# Altium project Regulator.PrjPcb
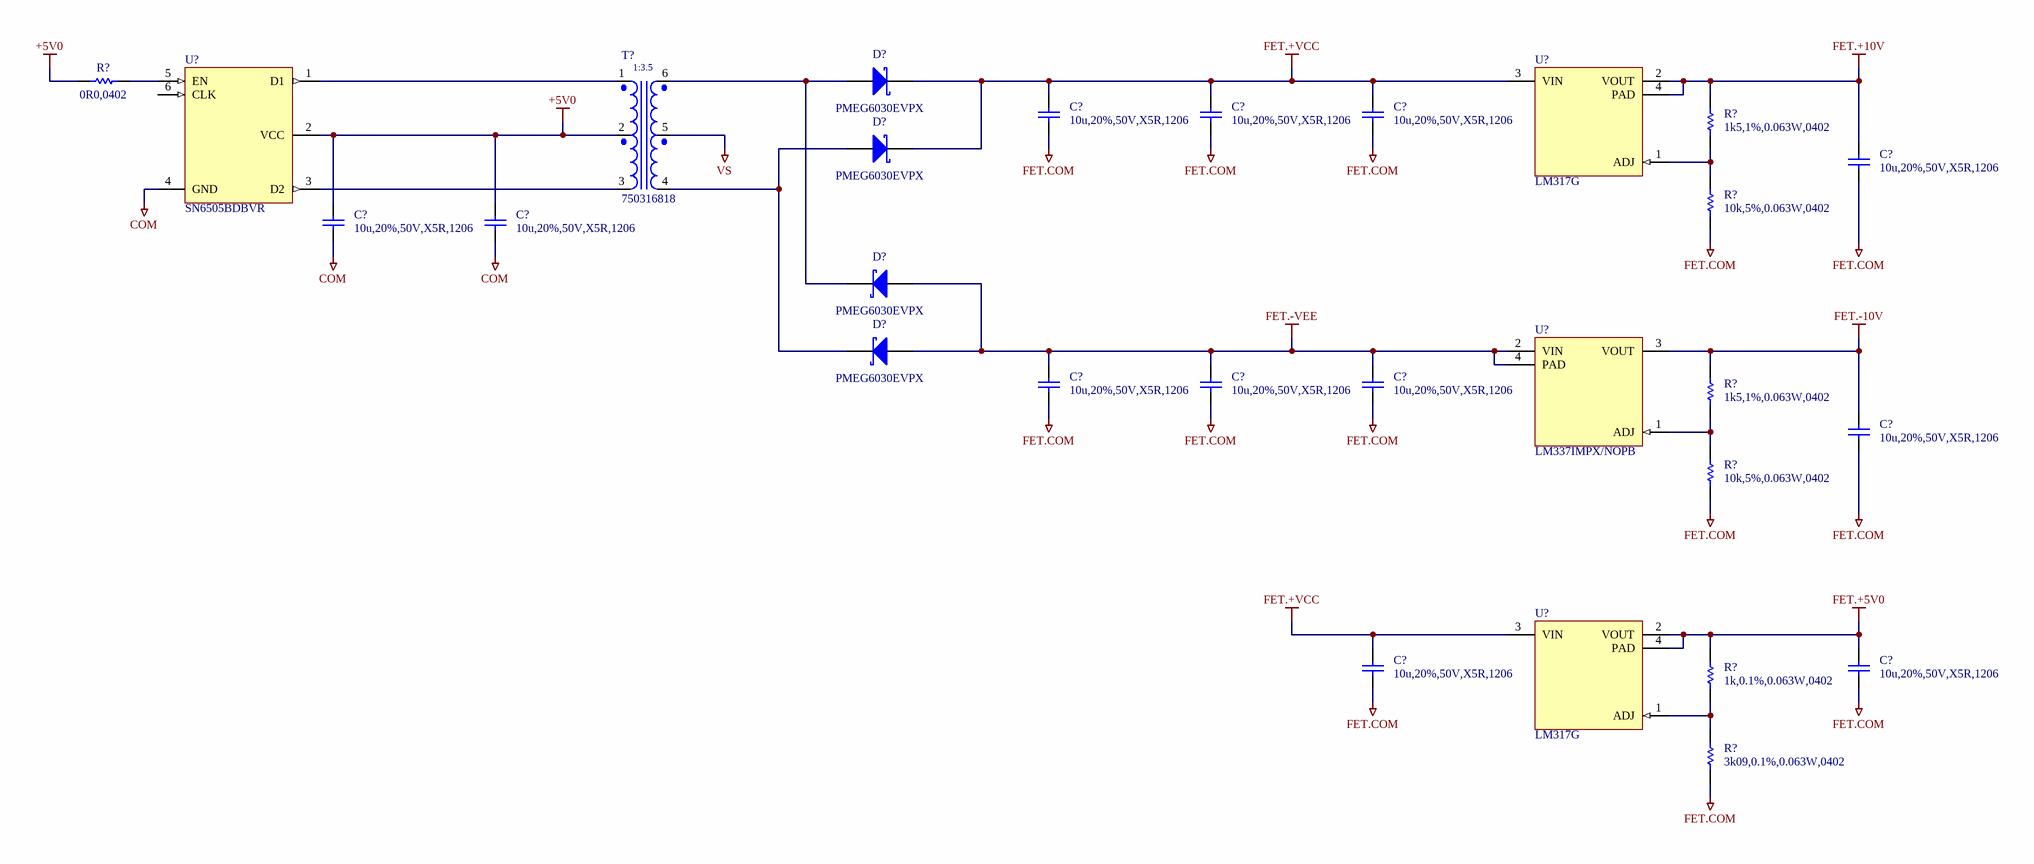
[diagram p0: FET Power.SchDoc]
4 sheets, 72 parts. Net scope: global (net labels, ports and power ports of the same name join across sheets).
Sheets:
  FET Power.SchDoc
  Pass Transistors.SchDoc
  DAC.SchDoc
  FET Microcontroller.SchDoc

## Sheet FET Power.SchDoc
size 406 x 304 mm; SheetNumber: 1; SheetTotal: 4

### Parts
(Parts that share a designator on the sheet are numbered #1, #2 ... from top to bottom, then left to right.)
C?#1  10u,20%,50V,X5R,1206  [CAPC3216X16N]
C?#2  10u,20%,50V,X5R,1206  [CAPC3216X16N]
C?#3  10u,20%,50V,X5R,1206  [CAPC3216X16N]
C?#4  10u,20%,50V,X5R,1206  [CAPC3216X16N]
C?#5  10u,20%,50V,X5R,1206  [CAPC3216X16N]
C?#6  10u,20%,50V,X5R,1206  [CAPC3216X16N]
C?#7  10u,20%,50V,X5R,1206  [CAPC3216X16N]
C?#8  10u,20%,50V,X5R,1206  [CAPC3216X16N]
C?#9  10u,20%,50V,X5R,1206  [CAPC3216X16N]
C?#10  10u,20%,50V,X5R,1206  [CAPC3216X16N]
C?#11  10u,20%,50V,X5R,1206  [CAPC3216X16N]
C?#12  10u,20%,50V,X5R,1206  [CAPC3216X16N]
D?#1  PMEG6030EVPX  [SODFL470X105-2N]
D?#2  PMEG6030EVPX  [SODFL470X105-2N]
D?#3  PMEG6030EVPX  [SODFL470X105-2N]
D?#4  PMEG6030EVPX  [SODFL470X105-2N]
R?#1  0R0,0402  [RESC1005X04N]
R?#2  1k5,1%,0.063W,0402  [RESC1005X04N]
R?#3  10k,5%,0.063W,0402  [RESC1005X04N]
R?#4  1k5,1%,0.063W,0402  [RESC1005X04N]
R?#5  10k,5%,0.063W,0402  [RESC1005X04N]
R?#6  1k,0.1%,0.063W,0402  [RESC1005X04N]
R?#7  3k09,0.1%,0.063W,0402  [RESC1005X04N]
T?  750316818  [WURTH_750316818]
U?#1  SN6505BDBVR  [TEXASINSTRUMENTS_PKG_]
U?#2  LM317G  [UMW_PKG_SOT223-3L]
U?#3  LM337IMPX/NOPB  [TEXASINSTRUMENTS_PKG_DCY]
U?#4  LM317G  [UMW_PKG_SOT223-3L]

### Nets
+5V0: C?#5.2 C?#6.2 R?#1.1 T?.2(PCT) U?#1.2(VCC)
COM: C?#5.1 C?#6.1 U?#1.4(GND)
FET.+5V0: C?#12.2 R?#6.2 U?#4.2(VOUT) U?#4.4(PAD)
FET.+10V: C?#4.2 R?#2.2 U?#2.2(VOUT) U?#2.4(PAD)
FET.+VCC: C?#1.2 C?#2.2 C?#3.2 C?#11.2 D?#1.1(K) D?#2.1(K) U?#2.3(VIN) U?#4.3(VIN)
FET.-10V: C?#10.2 R?#4.2 U?#3.3(VOUT)
FET.-VEE: C?#7.2 C?#8.2 C?#9.2 D?#3.2(A) D?#4.2(A) U?#3.2(VIN) U?#3.4(PAD)
FET.COM: C?#1.1 C?#2.1 C?#3.1 C?#4.1 C?#7.1 C?#8.1 C?#9.1 C?#10.1 C?#11.1 C?#12.1 R?#3.1 R?#5.1 R?#7.1  [project net HVOUT]
VS: T?.5(SCT)
NetD?#1_2: D?#1.2(A) D?#3.1(K) T?.6(S+)
NetD?#2_2: D?#2.2(A) D?#4.1(K) T?.4(S-)
NetR?#1_2: R?#1.2 U?#1.5(EN)
NetR?#2_1: R?#2.1 R?#3.2 U?#2.1(ADJ)
NetR?#4_1: R?#4.1 R?#5.2 U?#3.1(ADJ)
NetR?#6_1: R?#6.1 R?#7.2 U?#4.1(ADJ)
NetT?_1: T?.1(P+) U?#1.1(D1)
NetT?_3: T?.3(P-) U?#1.3(D2)

Not connected (* = marked no-connect by the designer): U?#1 6(CLK)

### Notes on the sheet
- Rev
- Sheet Name:
- Date:
- Sheet
- Designer:
- of
- (in symbol XFR,1-3.5,Lp=86uH,750316818) 1:3.5

### Library data of the parts
C?#1-C?#12 = CAP,Cer,10uF,50VDC,X5R,1206: 10ï¿½F ï¿½20% 50V Ceramic Capacitor X5R 1206 (3216 Metric); Manufacturer 1: Samsung Electro-Mechanics; Manufacturer 1 Part Number: CL31A106MBHNNNE; Vendor 1 Part Number: 1276-6736-1-ND; Vendor 1: Digikey; Part Name: CAP,Cer,10uF,50VDC,X5R,1206; CreatedBy: Judd Foster; HelpURL: https://www.samsungsem.com/resources/file/global/support/product_catalog/MLCC.pdf; Value: 10u
D?#1-D?#4 = DIODE,Schottky,60V,3A,SMD: DIODE SCHOTTKY 60V 3A SOD128; Manufacturer 1: Nexperia USA Inc.; Vendor 1 Part Number: 1727-1349-1-ND; Vendor 1: Digikey; Part Name: DIODE,Schottky,60V,3A,SMD; CreatedBy: Judd Foster; HelpURL: https://assets.nexperia.com/documents/data-sheet/PMEG6030EVP.pdf; Manufacturer 1 Part Number: PMEG6030EVPX
R?#1 = RES,0R0,0402: 0 Ohms Jumper 0.1W, 1/10W Chip Resistor 0402 (1005 Metric) Automotive AEC-Q200 Thick Film; Manufacturer 1: Panasonic Electronic Components; Manufacturer 1 Part Number: ERJ-2GE0R00X; Vendor 1 Part Number: P0.0JCT-ND; Vendor 1: Digikey; Value: 0R; Part Name: RES,0R0,0402; CreatedBy: Judd Foster; HelpURL: https://industrial.panasonic.com/cdbs/www-data/pdf/RDA0000/AOA0000C301.pdf
R?#2 R?#4 = RES,1k5,1%,0.063W,0402: 1.5 kOhms ï¿½1% 0.063W, 1/16W Chip Resistor 0402 (1005 Metric) Moisture Resistant Thick Film; Manufacturer 1: Yageo; Manufacturer 1 Part Number: RC0402FR-071K5L; Vendor 1 Part Number: 311-1.50KLRCT-ND; Vendor 1: Digikey; Part Name: RES,1k5,1%,0.063W,0402; CreatedBy: Judd Foster; HelpURL: https://www.yageo.com/upload/media/product/productsearch/datasheet/rchip/PYu-RC_Group_51_RoHS_L_10.pdf; Value: 1k5
R?#3 R?#5 = RES,10k,5%,0.063W,0402: 10 kOhms ï¿½5% 0.063W, 1/16W Chip Resistor 0402 (1005 Metric) Automotive AEC-Q200 Thick Film; Manufacturer 1: Stackpole Electronics Inc; Manufacturer 1 Part Number: RMCF0402JT10K0; Vendor 1 Part Number: RMCF0402JT10K0CT-ND; Vendor 1: DIgikey; Part Name: RES,10k,5%,0.063W,0402; CreatedBy: Judd Foster; HelpURL: https://www.seielect.com/catalog/sei-rmcf_rmcp.pdf; Value: 10k
R?#6 = RES,1k,0.1%,0.063W,0402: 1 kOhms Â±0.1% 0.063W, 1/16W Chip Resistor 0402 (1005 Metric) Thin Film; Manufacturer 1: YAGEO; Manufacturer 1 Part Number: RT0402BRE071KL; Vendor 1 Part Number: YAG2306CT-ND; Vendor 1: DigiKey; Part Name: RES,1k,0.1%,0.063W,0402; CreatedBy: Judd Foster; HelpURL: https://www.yageo.com/upload/media/product/app/datasheet/rchip/pyu-rt_1-to-0.01_rohs_l.pdf; Value: 1k
R?#7 = RES,3k09,0.1%,0.063W,0402: 3.09 kOhms ï¿½0.1% 0.063W, 1/16W Chip Resistor 0402 (1005 Metric) Thin Film; Manufacturer 1: YAGEO; Manufacturer 1 Part Number: RT0402BRD073K09L; Vendor 1 Part Number: YAG4252CT-ND; Vendor 1: Digikey; Part Name: RES,3k09,0.1%,0.063W,0402; CreatedBy: Judd Foster; HelpURL: https://www.yageo.com/upload/media/product/app/datasheet/rchip/pyu-rt_1-to-0.01_rohs_l.pdf; Value: 3k09,0.1%,0.063W,0402
T? = XFR,1-3.5,Lp=86uH,750316818: Forward, Push-Pull Converters For For DC/DC Converters SMPS Transformer 2500Vrms Isolation 400kHz Surface Mount; Manufacturer 1: WÃ¼rth Elektronik; Vendor 1 Part Number: 732-750316818CT-ND; Vendor 1: DigiKey; Part Name: XFR,1-3.5,Lp=86uH,750316818; CreatedBy: Judd Foster; HelpURL: https://www.we-online.com/components/products/datasheet/750316818.pdf; Manufacturer 1 Part Number: 750316818
U?#1 = SN6505BDBVR: Transformer Driver PMIC SOT-23-6; Manufacturer 1: Texas Instruments; Vendor 1 Part Number: 296-47311-1-ND; Vendor 1: DigiKey; Part Name: SN6505BDBVR; CreatedBy: Judd Foster; HelpURL: https://www.ti.com/general/docs/suppproductinfo.tsp?distId=10&gotoUrl=https%3A%2F%2Fwww.ti.com%2Flit%2Fgpn%2Fsn6505a; Manufacturer 1 Part Number: SN6505BDBVR
U?#2 U?#4 = LM317G: 75dB@(120Hz) 2.2A Adjustable 1.2V~37V Positive electrode 40V SOT-223 Voltage Regulators - Linear, Low Drop Out (LDO) Regulators ROHS; Manufacturer 1: UMW(Youtai Semiconductor Co., Ltd.); Vendor 1 Part Number: C347367; Vendor 1: LCSC; Part Name: LM317G; CreatedBy: Judd Foster; HelpURL: https://www.lcsc.com/datasheet/lcsc_datasheet_2411131159_UMW-Youtai-Semiconductor-Co---Ltd--LM317G_C347367.pdf; Manufacturer 1 Part Number: LM317G
U?#3 = LM337IMPX_NOPB: Linear Voltage Regulator IC Negative Adjustable 1 Output 1.5A SOT-223-4; Manufacturer 1: Texas Instruments; Vendor 1 Part Number: LM337IMPX/NOPBCT-ND; Vendor 1: DigiKey; Part Name: LM337IMPX_NOPB; CreatedBy: Judd Foster; HelpURL: https://www.ti.com/lit/ds/symlink/lm137.pdf?HQS=dis-dk-null-digikeymode-dsf-pf-null-wwe&ts=1743290709590&ref_url=https%253A%252F%252Fwww.ti.com%252Fgeneral%252Fdocs%252Fsuppproductinfo.tsp%253FdistId%253D10%2526gotoUrl%253Dhttps%253A%252F%252Fwww.ti.com%2; Manufacturer 1 Part Number: LM337IMPX/NOPB

## Sheet Pass Transistors.SchDoc
size 406 x 304 mm; SheetNumber: 2; SheetTotal: 4
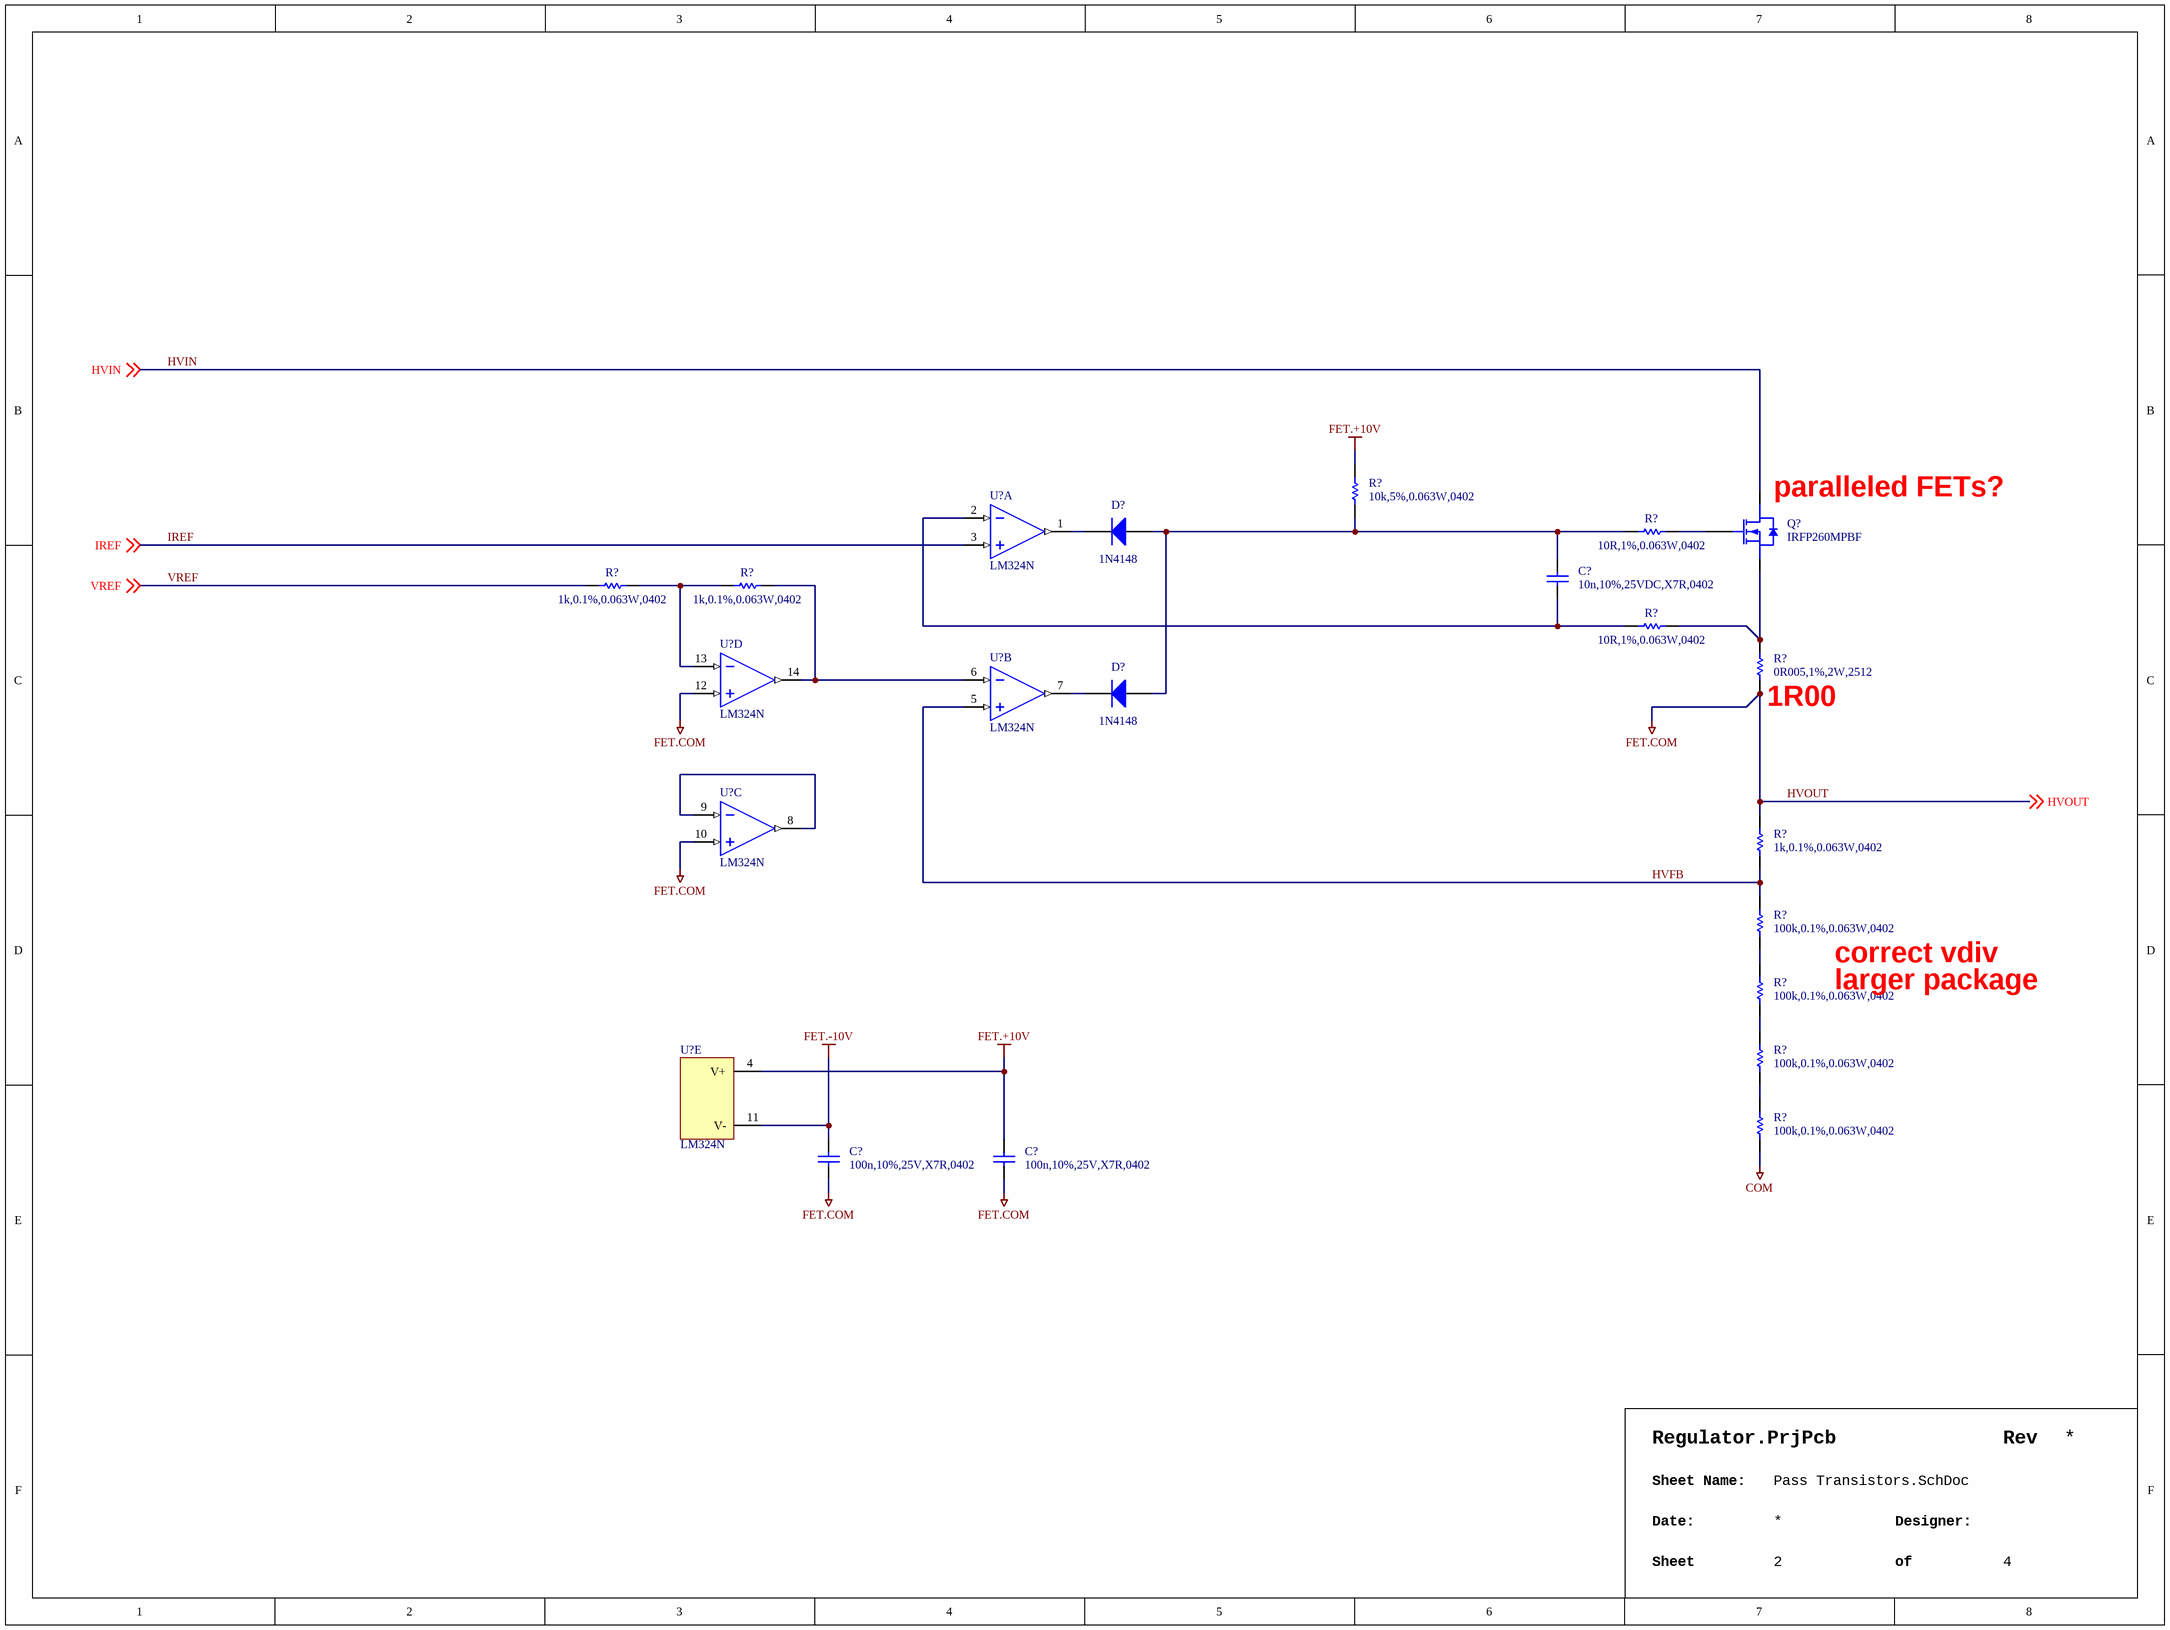
[diagram p1: Pass Transistors.SchDoc]

### Parts
(Parts that share a designator on the sheet are numbered #1, #2 ... from top to bottom, then left to right.)
C?#13  10n,10%,25VDC,X7R,0402  [CAPC1005X06N]
C?#14  100n,10%,25V,X7R,0402  [CAPC1005X06N]
C?#15  100n,10%,25V,X7R,0402  [CAPC1005X06N]
D?#5  1N4148  [ONSEMI_DO-35]
D?#6  1N4148  [ONSEMI_DO-35]
Q?  IRFP260MPBF  [INFINEON_PKG_TO247AD]
R?#8  10k,5%,0.063W,0402  [RESC1005X04N]
R?#9  10R,1%,0.063W,0402  [RESC1005X04N]
R?#10  1k,0.1%,0.063W,0402  [RESC1005X04N]
R?#11  1k,0.1%,0.063W,0402  [RESC1005X04N]
R?#12  10R,1%,0.063W,0402  [RESC1005X04N]
R?#13  0R005,1%,2W,2512  [OHMITE_PKG_MCS3264]
R?#14  1k,0.1%,0.063W,0402  [RESC1005X04N]
R?#15  100k,0.1%,0.063W,0402  [RESC1005X04N]
R?#16  100k,0.1%,0.063W,0402  [RESC1005X04N]
R?#17  100k,0.1%,0.063W,0402  [RESC1005X04N]
R?#18  100k,0.1%,0.063W,0402  [RESC1005X04N]
U?#5  LM324N  [TI_J0014A]  (part A of 5)
U?#6  LM324N  [TI_J0014A]  (part D of 5)
U?#7  LM324N  [TI_J0014A]  (part B of 5)
U?#8  LM324N  [TI_J0014A]  (part C of 5)
U?#9  LM324N  [TI_J0014A]  (part E of 5)

### Nets
COM: R?#18.1
FET.+10V: C?#15.2 R?#8.2 U?#9.4(V+)
FET.-10V: C?#14.2 U?#9.11(V-)
HVOUT: C?#14.1 C?#15.1 R?#13.1 R?#14.2 U?#6.12(IN4+) U?#8.10(IN3+) ; off-sheet HVOUT  [also labelled FET.COM]
HVFB: R?#14.1 R?#15.2 U?#7.5(IN2+)
HVIN: Q?.2(D) ; off-sheet HVIN
IREF: U?#5.3(IN1+) ; off-sheet IREF
VREF: R?#10.2 ; off-sheet VREF
NetC?#13_1: C?#13.1 R?#12.1 U?#5.2(IN1-)
NetC?#13_2: C?#13.2 D?#5.2(A) D?#6.2(A) R?#8.1 R?#9.1
NetD?#5_1: D?#5.1(K) U?#5.1(OUT1)
NetD?#6_1: D?#6.1(K) U?#7.7(OUT2)
NetQ?_1: Q?.1(G) R?#9.2
NetQ?_3: Q?.3(S) R?#12.2 R?#13.2
NetR?#10_1: R?#10.1 R?#11.2 U?#6.13(IN4-)
NetR?#11_1: R?#11.1 U?#6.14(OUT4) U?#7.6(IN2-)
NetR?#15_1: R?#15.1 R?#16.2
NetR?#16_1: R?#16.1 R?#17.2
NetR?#17_1: R?#17.1 R?#18.2
NetU?#8_8: U?#8.8(OUT3) U?#8.9(IN3-)

### Notes on the sheet
- (near Q?) paralleled FETs?
- (near R?#13) 1R00
- correct vdiv
- larger package
- Rev
- Sheet Name:
- Date:
- Sheet
- Designer:
- of

### Library data of the parts
C?#13 = CAP,Cer,10nF,10%,25VDC,X7R,0402: 10000pF ï¿½10% 25V Ceramic Capacitor X7R 0402 (1005 Metric); Manufacturer 1: Murata Electronics; Manufacturer 1 Part Number: GCM155R71E103KA37D; Vendor 1 Part Number: 490-6043-1-ND; Vendor 1: Digikey; Part Name: CAP,Cer,10nF,10%,25VDC,X7R,0402; CreatedBy: Judd Foster; HelpURL: https://psearch.en.murata.com/capacitor/product/GCM155R71E103KA37%23.pdf; Value: 10n,10%,25VDC,X7R,0402
C?#14 C?#15 = CAP,Cer,100nF,10%,25V,X7R,0402: 0.1ï¿½F ï¿½10% 25V Ceramic Capacitor X7R 0402 (1005 Metric); Manufacturer 1: Murata Electronics; Manufacturer 1 Part Number: GRM155R71E104KE14J; Vendor 1 Part Number: 490-14603-1-ND; Vendor 1: DigiKey; Value: 100nF; Part Name: CAP,Cer,100nF,10%,25V,X7R,0402; CreatedBy: Judd Foster; HelpURL: https://search.murata.co.jp/Ceramy/image/img/A01X/G101/ENG/GRM155R71E104KE14-01.pdf
D?#5 D?#6 = DIODE,Gen,100V,200mA,Axial,Thru: Diode 100 V 200mA Through Hole DO-35; Manufacturer 1: ON Semiconductor; Vendor 1 Part Number: 1N4148FS-ND; Vendor 1: Digikey; Part Name: DIODE,Gen,100V,200mA,Axial,Thru; CreatedBy: Judd Foster; HelpURL: https://www.onsemi.com/download/data-sheet/pdf/1n914-d.pdf; Manufacturer 1 Part Number: 1N4148
Q? = MOSFET,N Ch,200V,50A,IRFP260MPBF: N-Channel 200 V 50A (Tc) 300W (Tc) Through Hole TO-247AC; Manufacturer 1: Infineon Technologies; Vendor 1 Part Number: IRFP260MPBF-ND; Vendor 1: DigiKey; Part Name: MOSFET,N Ch,200V,50A,IRFP260MPBF; CreatedBy: Judd Foster; HelpURL: https://www.infineon.com/dgdl/irfp260mpbf.pdf?fileId=5546d462533600a40153562894e91fe0; Manufacturer 1 Part Number: IRFP260MPBF
R?#8 = RES,10k,5%,0.063W,0402: as R?#3 on sheet FET Power; Part Name: RES,10k,5%,0.063W,0402; CreatedBy: Judd Foster; HelpURL: https://www.seielect.com/catalog/sei-rmcf_rmcp.pdf; Value: 10k
R?#9 R?#12 = RES,10R,1%,0.063W,0402: 10 Ohms ï¿½1% 0.063W, 1/16W Chip Resistor 0402 (1005 Metric) Automotive AEC-Q200 Thick Film; Manufacturer 1: Panasonic Electronic Components; Manufacturer 1 Part Number: ERJ-2RKF10R0X; Vendor 1 Part Number: P10.0LCT-ND; Vendor 1: Digikey; Part Name: RES,10R,1%,0.063W,0402; CreatedBy: Judd Foster; HelpURL: https://industrial.panasonic.com/cdbs/www-data/pdf/RDA0000/AOA0000C304.pdf; Value: 10R
R?#10 R?#11 R?#14 = RES,1k,0.1%,0.063W,0402: as R?#6 on sheet FET Power; Part Name: RES,1k,0.1%,0.063W,0402; CreatedBy: Judd Foster; HelpURL: https://www.yageo.com/upload/media/product/app/datasheet/rchip/pyu-rt_1-to-0.01_rohs_l.pdf; Value: 1k
R?#13 = RES,0R005,1%,2W,2512: 5 mOhms Â±1% 2W Chip Resistor 2512 (6432 Metric) Current Sense, Flame Retardant Coating, Safety Metal Element; Manufacturer 1: Ohmite; Manufacturer 1 Part Number: MCS3264R005FER; Vendor 1 Part Number: MCS3264R005FERCT-ND; Vendor 1: DigiKey; Value: 5m; Part Name: RES,0R005,1%,2W,2512; CreatedBy: Judd Foster; HelpURL: https://www.ohmite.com/assets/images/res-mcs.pdf
R?#15-R?#18 = RES,100k,0.1%,0.063W,0402: 100 kOhms ï¿½0.1% 0.063W, 1/16W Chip Resistor 0402 (1005 Metric) Thin Film; Manufacturer 1: YAGEO; Manufacturer 1 Part Number: RT0402BRE07100KL; Vendor 1 Part Number: YAG2304CT-ND; Vendor 1: Digikey; Part Name: RES,100k,0.1%,0.063W,0402; CreatedBy: Judd Foster; HelpURL: https://www.yageo.com/upload/media/product/app/datasheet/rchip/pyu-rt_1-to-0.01_rohs_l.pdf; Value: 100k
U?#5-U?#9 = LM324N: General Purpose Amplifier 4 Circuit 14-PDIP; Manufacturer 1: Texas Instruments; Vendor 1 Part Number: 296-1391-5-ND; Vendor 1: Digikey; Part Name: LM324N; CreatedBy: Judd Foster; HelpURL: https://www.ti.com/lit/ds/symlink/lm224.pdf?HQS=dis-dk-null-digikeymode-dsf-pf-null-wwe&ts=1715317448370; Manufacturer 1 Part Number: LM324N

## Sheet DAC.SchDoc
size 406 x 304 mm; SheetNumber: 3; SheetTotal: 3
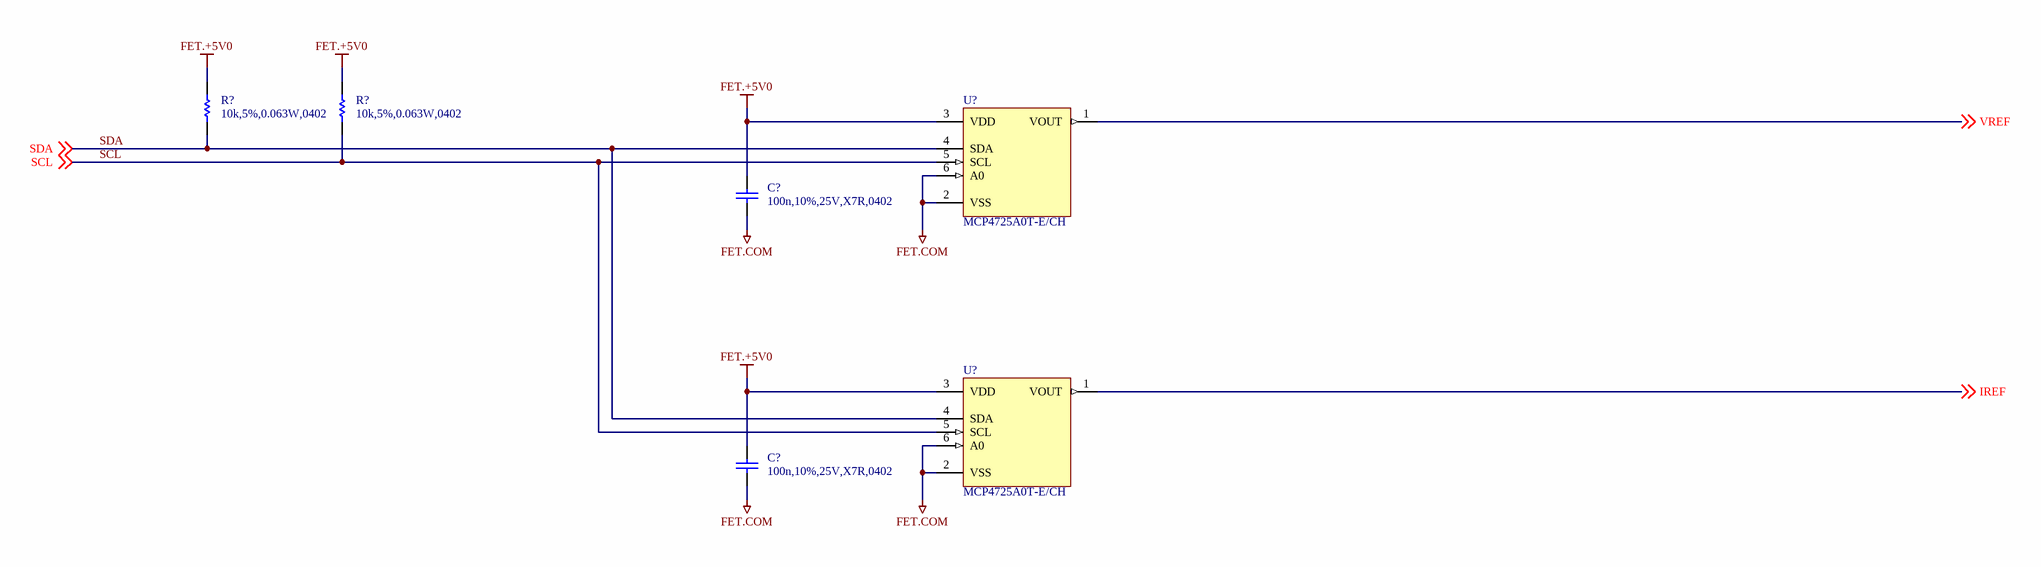
[diagram p2: DAC.SchDoc]

### Parts
(Parts that share a designator on the sheet are numbered #1, #2 ... from top to bottom, then left to right.)
C?#16  100n,10%,25V,X7R,0402  [CAPC1005X06N]
C?#17  100n,10%,25V,X7R,0402  [CAPC1005X06N]
R?#19  10k,5%,0.063W,0402  [RESC1005X04N]
R?#20  10k,5%,0.063W,0402  [RESC1005X04N]
U?#10  MCP4725A0T-E/CH  [SOTFL95P260X145-6]
U?#11  MCP4725A0T-E/CH  [SOTFL95P260X145-6]

### Nets
FET.+5V0: C?#16.2 C?#17.2 R?#19.2 R?#20.2 U?#10.3(VDD) U?#11.3(VDD)
FET.COM: C?#16.1 C?#17.1 U?#10.2(VSS) U?#10.6(A0) U?#11.2(VSS) U?#11.6(A0)  [project net HVOUT]
IREF: U?#11.1(VOUT) ; off-sheet IREF
SCL: R?#20.1 U?#10.5(SCL) U?#11.5(SCL) ; off-sheet SCL
SDA: R?#19.1 U?#10.4(SDA) U?#11.4(SDA) ; off-sheet SDA
VREF: U?#10.1(VOUT) ; off-sheet VREF

### Notes on the sheet
- Rev
- Sheet Name:
- Date:
- Sheet
- Designer:
- of

### Library data of the parts
C?#16 C?#17 = CAP,Cer,100nF,10%,25V,X7R,0402: as C?#14 on sheet Pass Transistors; Part Name: CAP,Cer,100nF,10%,25V,X7R,0402; CreatedBy: Judd Foster; HelpURL: https://search.murata.co.jp/Ceramy/image/img/A01X/G101/ENG/GRM155R71E104KE14-01.pdf
R?#19 R?#20 = RES,10k,5%,0.063W,0402: as R?#3 on sheet FET Power; Part Name: RES,10k,5%,0.063W,0402; CreatedBy: Judd Foster; HelpURL: https://www.seielect.com/catalog/sei-rmcf_rmcp.pdf; Value: 10k
U?#10 U?#11 = MCP4725A0T-E/CH: 6us 12 I2C 2.7V~5.5V SOT-23-6 Digital To Analog Converters (DACs) ROHS; Manufacturer 1: Microchip; Vendor 1 Part Number: C144198; Vendor 1: LCSC; Part Name: MCP4725A0T-E/CH; CreatedBy: Judd Foster; HelpURL: https://datasheet.lcsc.com/lcsc/1811151442_Microchip-Tech-MCP4725A0T-E-CH_C144198.pdf; Manufacturer 1 Part Number: MCP4725A0T-E/CH

## Sheet FET Microcontroller.SchDoc
size 406 x 304 mm; SheetNumber: 4; SheetTotal: 4
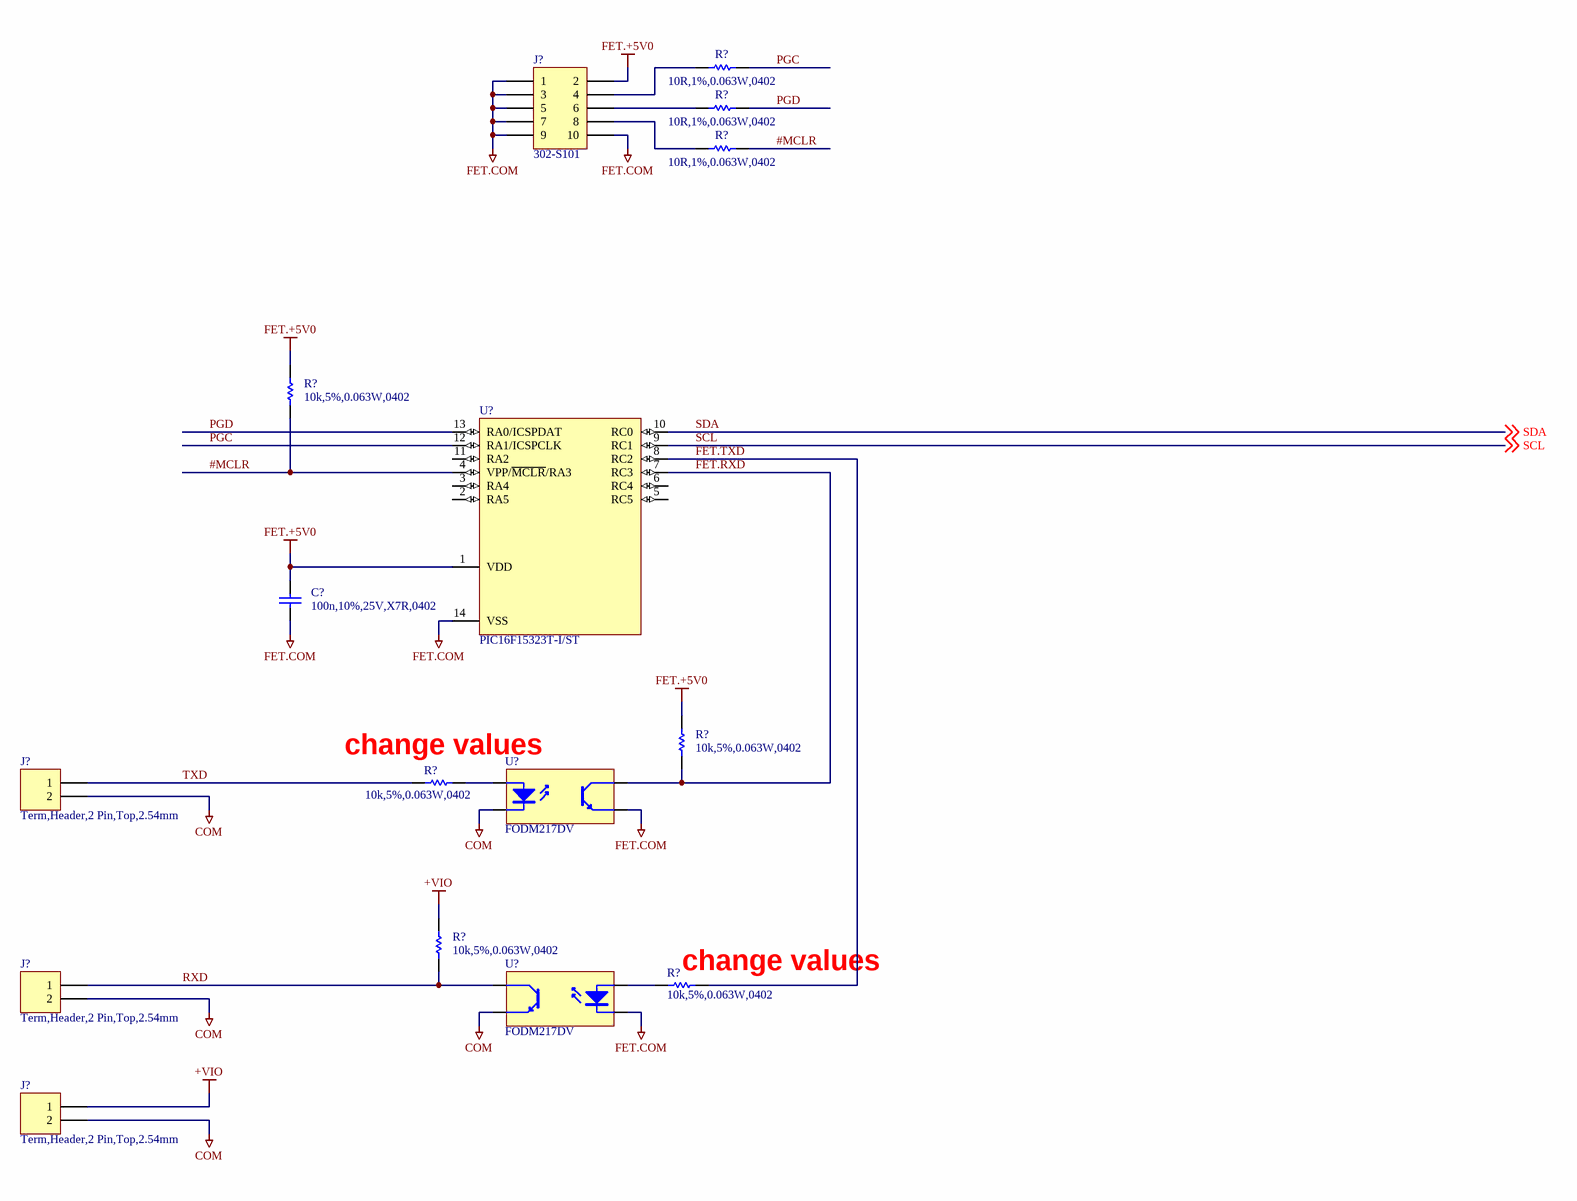
[diagram p3: FET Microcontroller.SchDoc]

### Parts
(Parts that share a designator on the sheet are numbered #1, #2 ... from top to bottom, then left to right.)
C?#18  100n,10%,25V,X7R,0402  [CAPC1005X06N]
J?#1  302-S101  [ONSHORE_302-S101]
J?#2  Term,Header,2 Pin,Top,2.54mm  [WURTH_61300211121]
J?#3  Term,Header,2 Pin,Top,2.54mm  [WURTH_61300211121]
J?#4  Term,Header,2 Pin,Top,2.54mm  [WURTH_61300211121]
R?#21  10R,1%,0.063W,0402  [RESC1005X04N]
R?#22  10R,1%,0.063W,0402  [RESC1005X04N]
R?#23  10R,1%,0.063W,0402  [RESC1005X04N]
R?#24  10k,5%,0.063W,0402  [RESC1005X04N]
R?#25  10k,5%,0.063W,0402  [RESC1005X04N]
R?#26  10k,5%,0.063W,0402  [RESC1005X04N]
R?#27  10k,5%,0.063W,0402  [RESC1005X04N]
R?#28  10k,5%,0.063W,0402  [RESC1005X04N]
U?#12  PIC16F15323T-I/ST  [MICROCHIP_PKG_TSSOP-14(C04-2087A)]
U?#13  FODM217DV  [ONSEMI_MFP4-2.5X4.4]
U?#14  FODM217DV  [ONSEMI_MFP4-2.5X4.4]

### Nets
+VIO: J?#4.1 R?#27.2
COM: J?#2.2 J?#3.2 J?#4.2 U?#13.2(K) U?#14.3(E)
FET.+5V0: C?#18.2 J?#1.2 R?#24.2 R?#25.2 U?#12.1(VDD)
FET.COM: C?#18.1 J?#1.1 J?#1.3 J?#1.5 J?#1.7 J?#1.9 J?#1.10 U?#12.14(VSS) U?#13.3(E) U?#14.2(K)  [project net HVOUT]
#MCLR: R?#23.2 R?#24.1 U?#12.4(VPP/~{MCLR}/RA3)
FET.RXD: R?#25.1 U?#12.7(RC3) U?#13.4(C)
FET.TXD: R?#28.1 U?#12.8(RC2)
PGC: R?#21.2 U?#12.12(RA1/ICSPCLK)
PGD: R?#22.2 U?#12.13(RA0/ICSPDAT)
RXD: J?#3.1 R?#27.1 U?#14.4(C)
SCL: U?#12.9(RC1) ; off-sheet SCL
SDA: U?#12.10(RC0) ; off-sheet SDA
TXD: J?#2.1 R?#26.2
NetJ?#1_4: J?#1.4 R?#21.1
NetJ?#1_6: J?#1.6 R?#22.1
NetJ?#1_8: J?#1.8 R?#23.1
NetR?#26_1: R?#26.1 U?#13.1(A)
NetR?#28_2: R?#28.2 U?#14.1(A)

Not connected (* = marked no-connect by the designer): U?#12 2(RA5) 3(RA4) 5(RC5) 6(RC4) 11(RA2)

### Notes on the sheet
- change values
- (near R?#28) change values
- Rev
- Sheet Name:
- Date:
- Sheet
- Designer:
- of

### Library data of the parts
C?#18 = CAP,Cer,100nF,10%,25V,X7R,0402: as C?#14 on sheet Pass Transistors; Part Name: CAP,Cer,100nF,10%,25V,X7R,0402; CreatedBy: Judd Foster; HelpURL: https://search.murata.co.jp/Ceramy/image/img/A01X/G101/ENG/GRM155R71E104KE14-01.pdf
J?#1 = Term,Header,5x2 Pin,2.54mm,Thru: Connector Header Through Hole 10 position 0.100" (2.54mm); Manufacturer 1: On Shore Technology Inc.; Vendor 1 Part Number: ED1543-ND; Vendor 1: Digikey; Part Name: Term,Header,5x2 Pin,2.54mm,Thru; CreatedBy: Judd Foster; HelpURL: https://mm.digikey.com/Volume0/opasdata/d220001/medias/docus/6025/302-S.pdf; Manufacturer 1 Part Number: 302-S101
J?#2-J?#4 = Term,Header,2 Pin,Top,2.54mm: Connector Header Through Hole 2 position 0.100" (2.54mm); Manufacturer 1: WÃ¼rth Elektronik; Manufacturer 1 Part Number: 61300211121; Vendor 1 Part Number: 732-5315-ND; Vendor 1: DigiKey; Part Name: Term,Header,2 Pin,Top,2.54mm; CreatedBy: Judd Foster; HelpURL: https://www.we-online.com/components/products/datasheet/61300211121.pdf
R?#21-R?#23 = RES,10R,1%,0.063W,0402: as R?#9 on sheet Pass Transistors; Part Name: RES,10R,1%,0.063W,0402; CreatedBy: Judd Foster; HelpURL: https://industrial.panasonic.com/cdbs/www-data/pdf/RDA0000/AOA0000C304.pdf; Value: 10R
R?#24-R?#28 = RES,10k,5%,0.063W,0402: as R?#3 on sheet FET Power; Part Name: RES,10k,5%,0.063W,0402; CreatedBy: Judd Foster; HelpURL: https://www.seielect.com/catalog/sei-rmcf_rmcp.pdf; Value: 10k
U?#12 = PIC16F15323T-I_ST: PIC PICÂ® XLPâ„¢ 16F Microcontroller IC 8-Bit 32MHz 3.5KB (2K x 14) FLASH 14-TSSOP; Manufacturer 1: Microchip Technology; Vendor 1 Part Number: PIC16F15323T-I/STCT-ND; Vendor 1: DigiKey; Part Name: PIC16F15323T-I_ST; CreatedBy: Judd Foster; HelpURL: https://ww1.microchip.com/downloads/en/DeviceDoc/PIC16_L_F15313_23_Data_Sheet_40001897C.pdf; Manufacturer 1 Part Number: PIC16F15323T-I/ST
U?#13 U?#14 = OPTO,Phototrans,3750Vrms,SMD: Optoisolator Transistor Output 3750Vrms Channel 4-SOP; Manufacturer 1: onsemi; Vendor 1 Part Number: FODM217DVOS-ND; Vendor 1: Digikey; Part Name: OPTO,Phototrans,3750Vrms,SMD; CreatedBy: Judd Foster; HelpURL: https://www.onsemi.com/pdf/datasheet/fodm214-d.pdf; Manufacturer 1 Part Number: FODM217DV

## Nets that join several sheets
COM: FET Power (C?#5.1 C?#6.1 U?#1.4), Pass Transistors (R?#18.1), FET Microcontroller (5 pins)
FET.+5V0: FET Power (C?#12.2 R?#6.2 U?#4.2 U?#4.4), DAC (6 pins), FET Microcontroller (5 pins)
FET.+10V: FET Power (C?#4.2 R?#2.2 U?#2.2 U?#2.4), Pass Transistors (C?#15.2 R?#8.2 U?#9.4)
FET.-10V: FET Power (C?#10.2 R?#4.2 U?#3.3), Pass Transistors (C?#14.2 U?#9.11)
HVOUT: FET Power (13 pins), Pass Transistors (6 pins), DAC (6 pins), FET Microcontroller (10 pins)
IREF: Pass Transistors (U?#5.3), DAC (U?#11.1)
SCL: DAC (R?#20.1 U?#10.5 U?#11.5), FET Microcontroller (U?#12.9)
SDA: DAC (R?#19.1 U?#10.4 U?#11.4), FET Microcontroller (U?#12.10)
VREF: Pass Transistors (R?#10.2), DAC (U?#10.1)